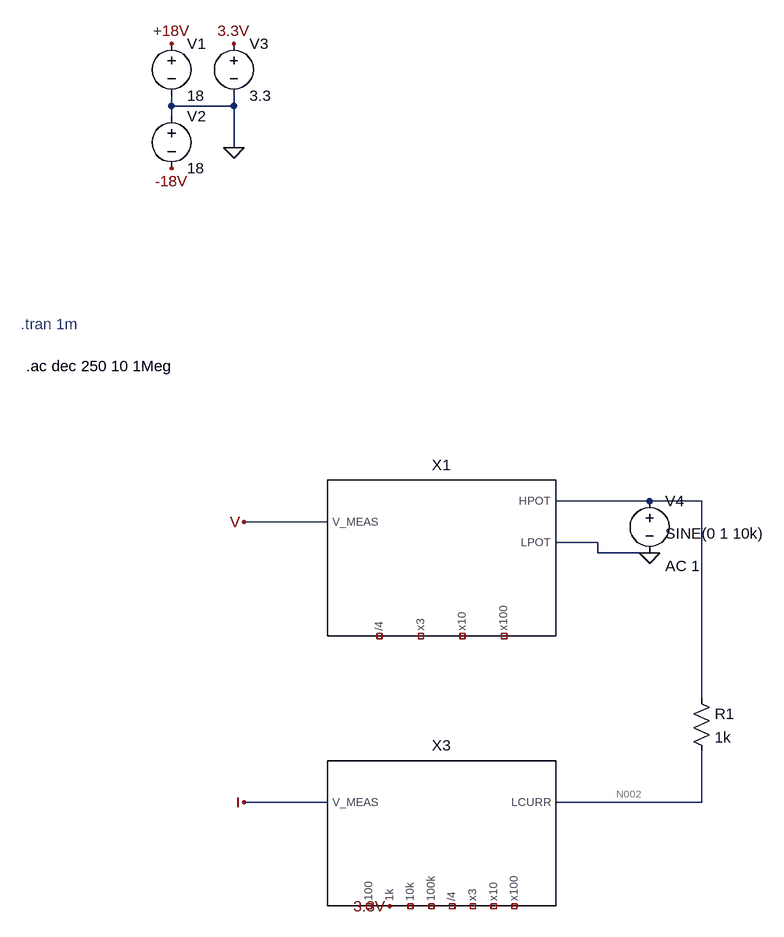
[diagram p0: schematic Characterise.asc]
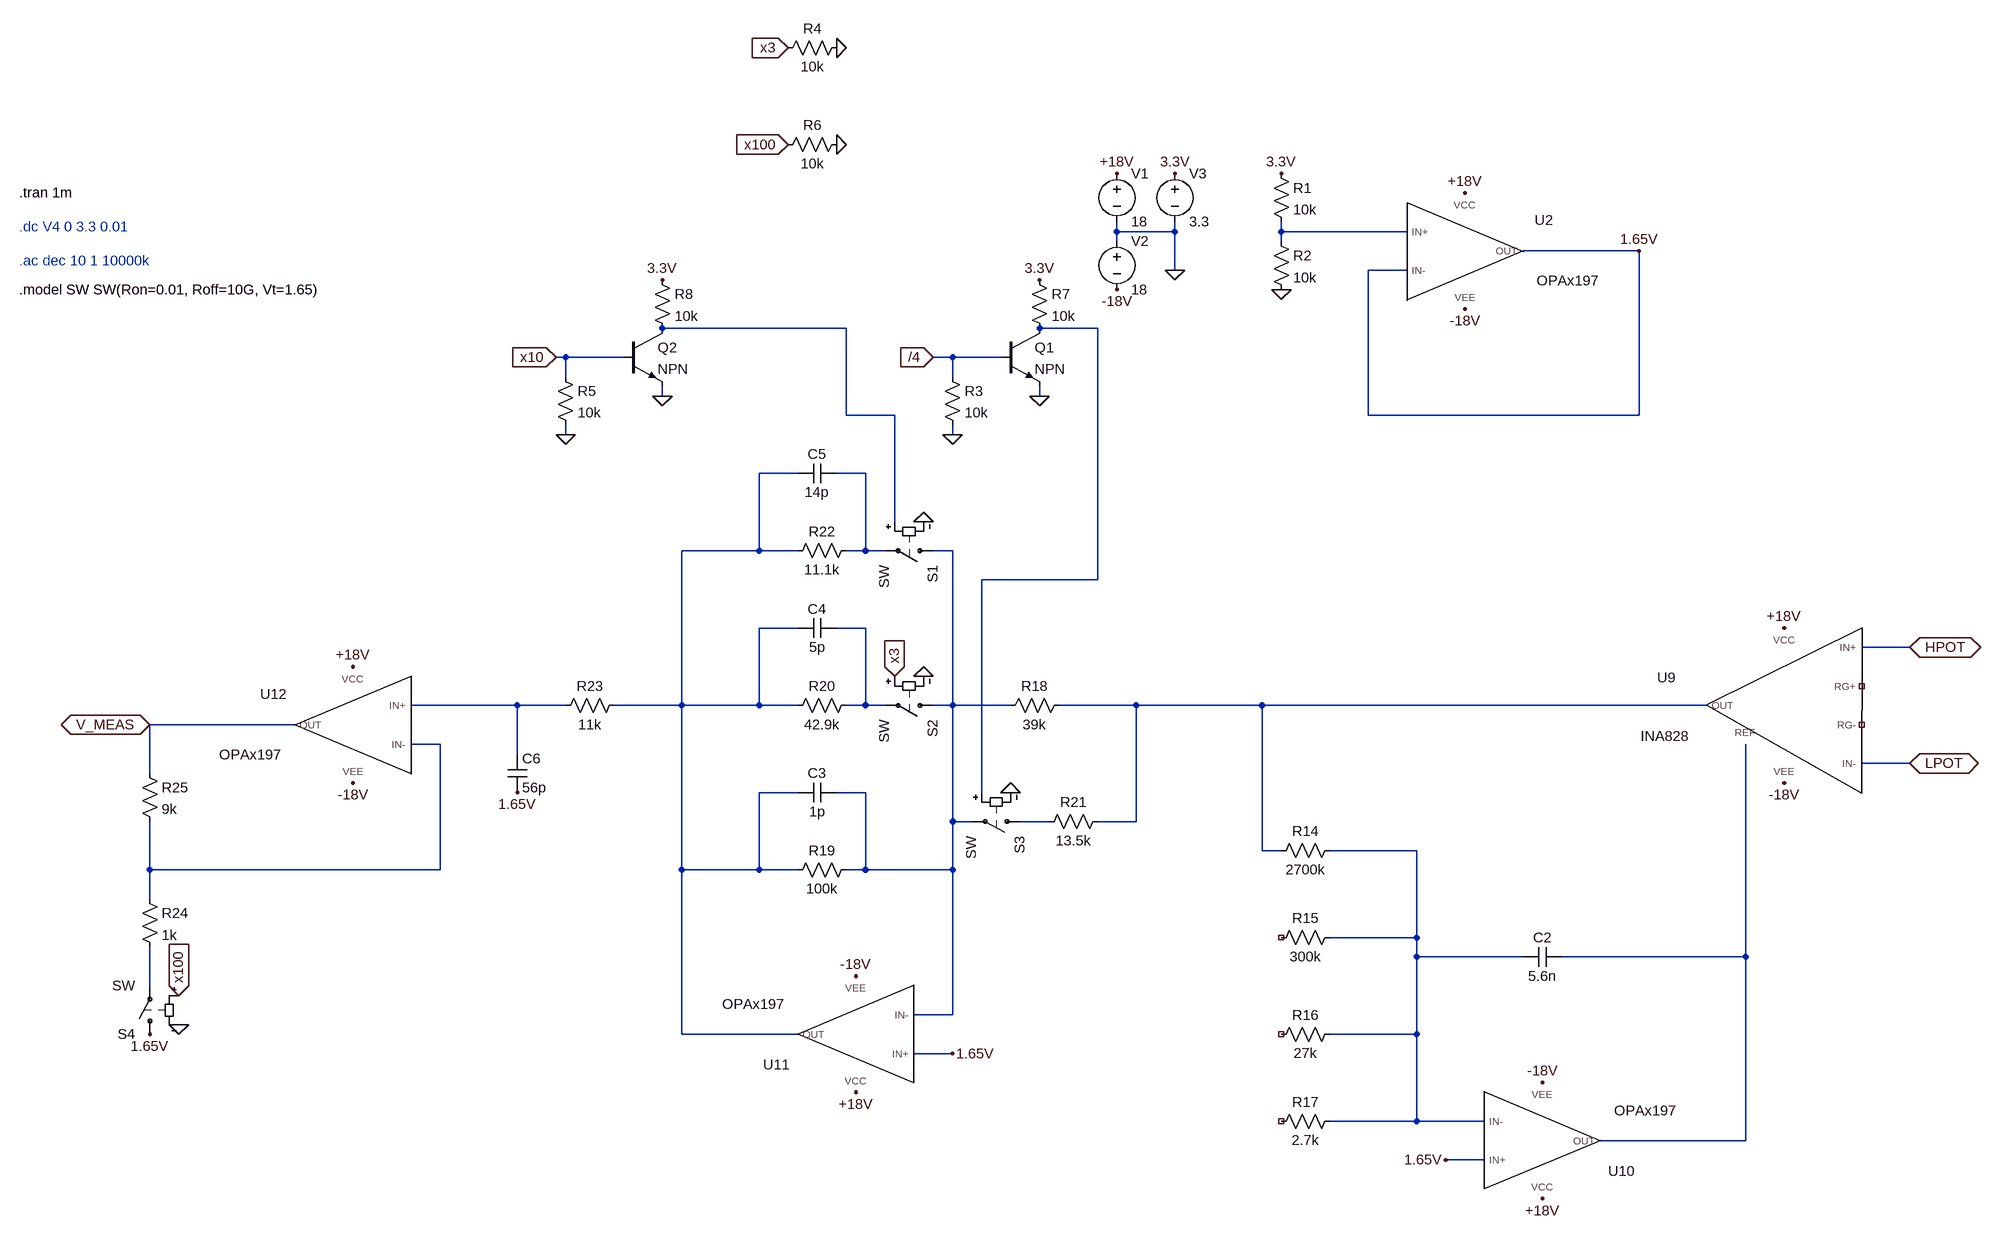
[diagram p1: sub-circuit vamp.asc]
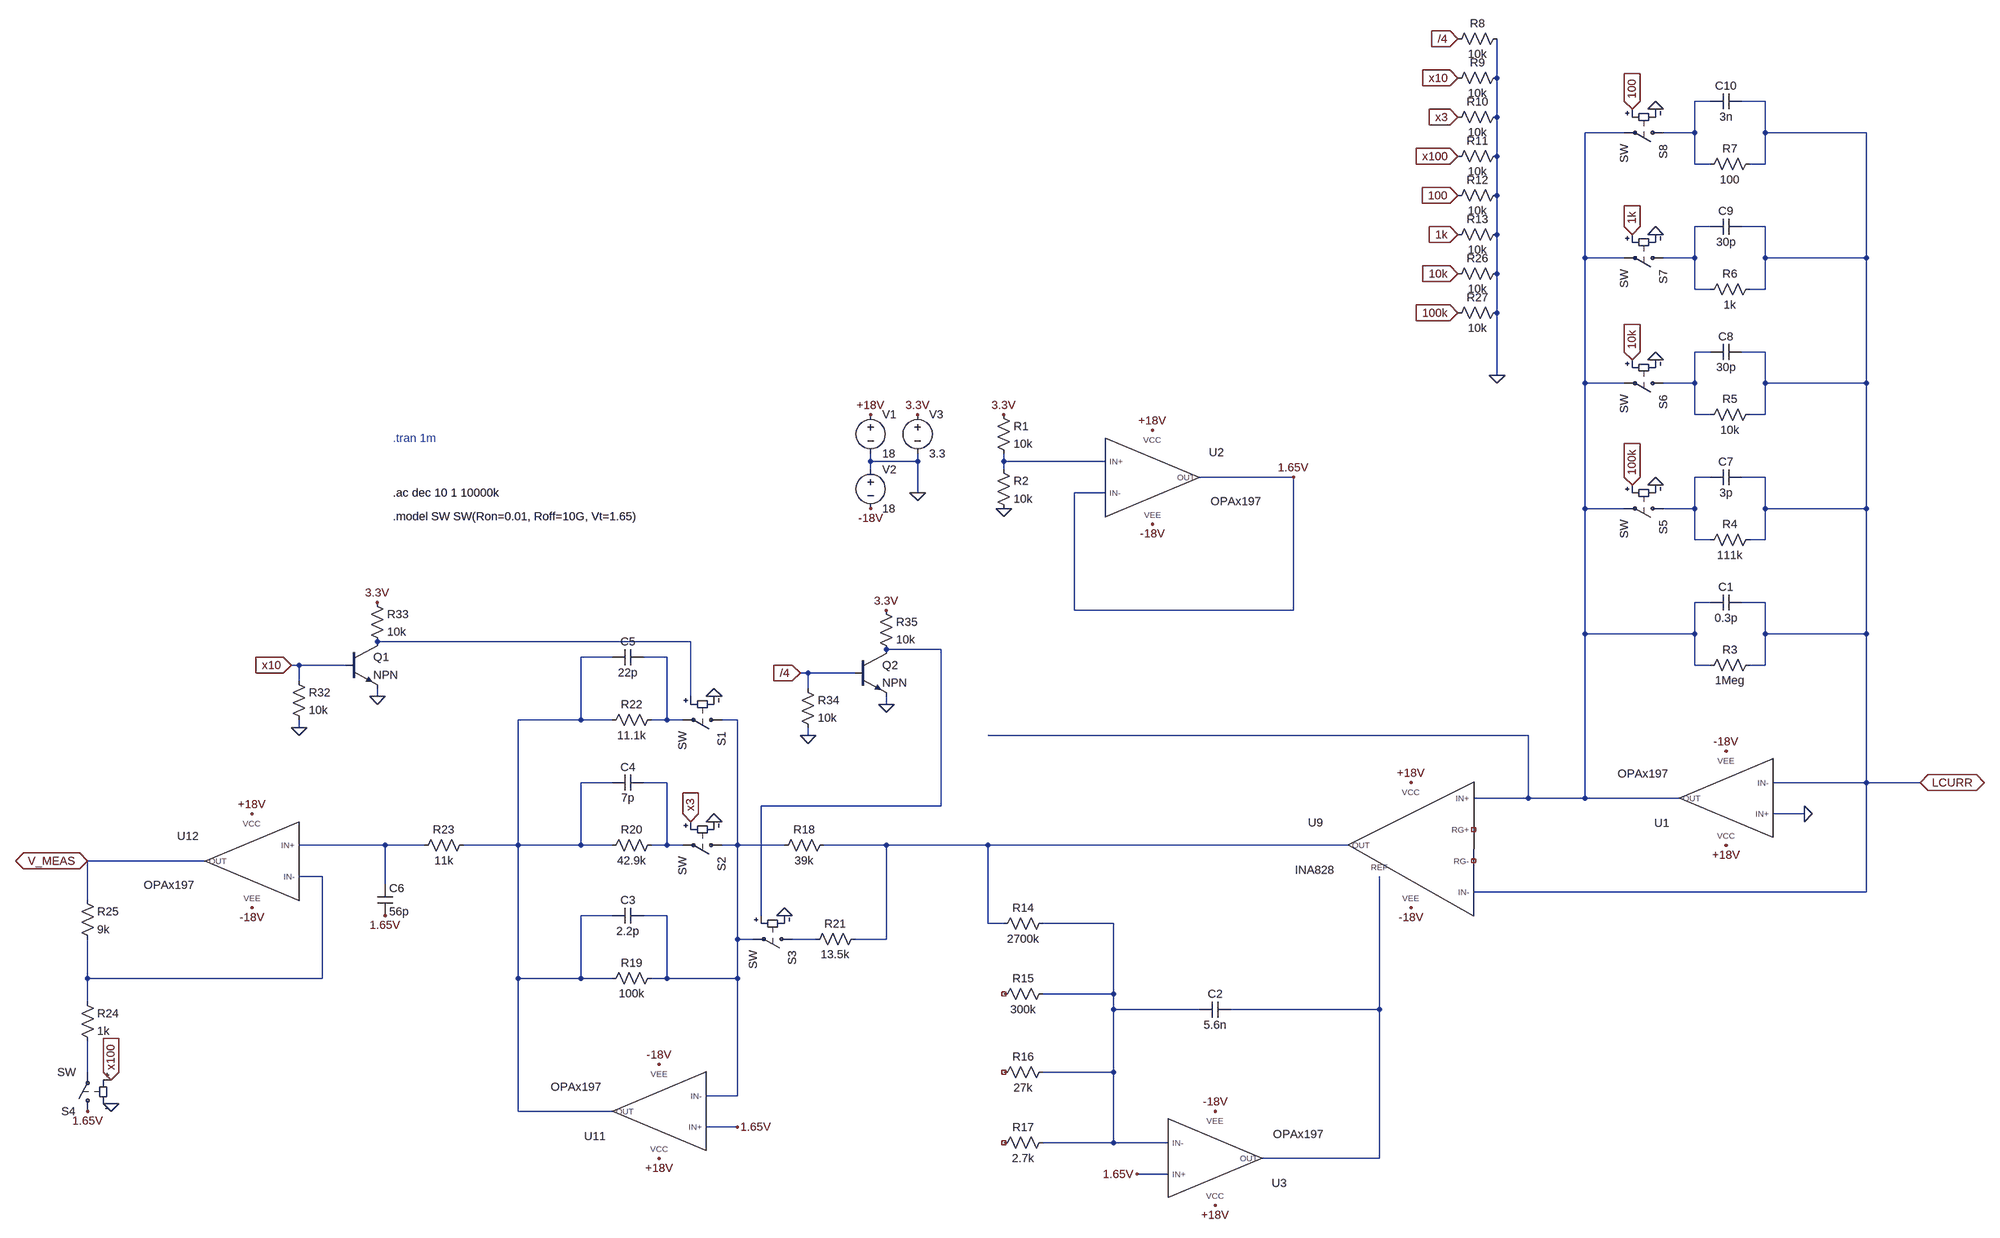
[diagram p2: sub-circuit iamp.asc]
Characterise.asc, the LTspice schematic file:
Version 4.1
SHEET 1 1460 892
WIRE -288 -544 -288 -560
WIRE -192 -544 -192 -560
WIRE -192 -544 -288 -544
WIRE -288 -528 -288 -544
WIRE -192 -480 -192 -544
WIRE 448 64 304 64
WIRE 528 64 448 64
WIRE -48 96 -176 96
WIRE 368 128 304 128
WIRE 368 144 368 128
WIRE 448 144 368 144
WIRE 528 368 528 64
WIRE -48 528 -176 528
WIRE 528 528 528 448
WIRE 528 528 304 528
FLAG -192 -480 0
FLAG -288 -640 +18V
FLAG -288 -448 -18V
FLAG -192 -640 3.3V
FLAG 448 144 0
FLAG -176 96 V
FLAG 48 688 3.3V
FLAG -176 528 I
SYMBOL voltage -288 -656 R0
WINDOW 123 0 0 Left 0
WINDOW 39 0 0 Left 0
SYMATTR InstName V1
SYMATTR Value 18
SYMBOL voltage -288 -544 R0
WINDOW 123 0 0 Left 0
WINDOW 39 0 0 Left 0
SYMATTR InstName V2
SYMATTR Value 18
SYMBOL voltage -192 -656 R0
WINDOW 123 0 0 Left 0
WINDOW 39 0 0 Left 0
SYMATTR InstName V3
SYMATTR Value 3.3
SYMBOL voltage 448 48 R0
WINDOW 3 24 66 Left 2
WINDOW 123 24 116 Left 2
WINDOW 39 0 0 Left 0
SYMATTR Value SINE(0 1 10k)
SYMATTR Value2 AC 1
SYMATTR InstName V4
SYMBOL Vamp 128 96 R0
SYMATTR InstName X1
SYMBOL Iamp 128 592 R0
SYMATTR InstName X3
SYMBOL res 512 352 R0
SYMATTR InstName R1
SYMATTR Value 1k
TEXT -520 -208 Left 2 ;.tran 1m
TEXT -512 -144 Left 2 !.ac dec 250 10 1Meg

vamp.asc, the sub-circuit schematic file:
Version 4.1
SHEET 1 2076 5472
WIRE -16 1648 -16 1632
WIRE 80 1648 80 1632
WIRE 80 1648 -16 1648
WIRE 256 1648 256 1632
WIRE 464 1648 256 1648
WIRE -16 1664 -16 1648
WIRE 256 1664 256 1648
WIRE 848 1680 656 1680
WIRE 80 1712 80 1648
WIRE 464 1712 400 1712
WIRE -464 1808 -768 1808
WIRE -48 1808 -144 1808
WIRE -928 1856 -944 1856
WIRE -832 1856 -928 1856
WIRE -288 1856 -320 1856
WIRE -208 1856 -288 1856
WIRE -928 1888 -928 1856
WIRE -288 1888 -288 1856
WIRE -768 1920 -768 1904
WIRE -144 1920 -144 1904
WIRE -464 1952 -464 1808
WIRE -384 1952 -464 1952
WIRE 400 1952 400 1712
WIRE 848 1952 848 1680
WIRE 848 1952 400 1952
WIRE -928 1984 -928 1968
WIRE -288 1984 -288 1968
WIRE -544 2048 -608 2048
WIRE -432 2048 -480 2048
WIRE -384 2128 -384 1952
WIRE -608 2176 -608 2048
WIRE -608 2176 -736 2176
WIRE -544 2176 -608 2176
WIRE -432 2176 -432 2048
WIRE -432 2176 -464 2176
WIRE -400 2176 -432 2176
WIRE -288 2176 -320 2176
WIRE -48 2224 -48 1808
WIRE -48 2224 -240 2224
WIRE -544 2304 -608 2304
WIRE -432 2304 -480 2304
WIRE 1296 2336 1216 2336
WIRE -1008 2432 -1184 2432
WIRE -928 2432 -1008 2432
WIRE -736 2432 -736 2176
WIRE -736 2432 -848 2432
WIRE -608 2432 -608 2304
WIRE -608 2432 -736 2432
WIRE -544 2432 -608 2432
WIRE -432 2432 -432 2304
WIRE -432 2432 -464 2432
WIRE -400 2432 -432 2432
WIRE -288 2432 -288 2176
WIRE -288 2432 -320 2432
WIRE -192 2432 -288 2432
WIRE 16 2432 -112 2432
WIRE 224 2432 16 2432
WIRE 960 2432 224 2432
WIRE -1376 2464 -1616 2464
WIRE -1136 2496 -1184 2496
WIRE -1008 2512 -1008 2432
WIRE 1296 2528 1216 2528
WIRE -1616 2544 -1616 2464
WIRE -544 2576 -608 2576
WIRE -432 2576 -480 2576
WIRE -240 2576 -240 2224
WIRE -288 2624 -288 2432
WIRE -256 2624 -288 2624
WIRE -128 2624 -176 2624
WIRE 16 2624 16 2432
WIRE 16 2624 -48 2624
WIRE 224 2672 224 2432
WIRE 256 2672 224 2672
WIRE 480 2672 336 2672
WIRE -1616 2704 -1616 2624
WIRE -1136 2704 -1136 2496
WIRE -1136 2704 -1616 2704
WIRE -736 2704 -736 2432
WIRE -608 2704 -608 2576
WIRE -608 2704 -736 2704
WIRE -544 2704 -608 2704
WIRE -432 2704 -432 2576
WIRE -432 2704 -464 2704
WIRE -288 2704 -288 2624
WIRE -288 2704 -432 2704
WIRE -1616 2752 -1616 2704
WIRE 480 2816 480 2672
WIRE 480 2816 336 2816
WIRE 480 2848 480 2816
WIRE 656 2848 480 2848
WIRE 1024 2848 1024 2496
WIRE 1024 2848 720 2848
WIRE -1616 2896 -1616 2832
WIRE -288 2944 -288 2704
WIRE -288 2944 -352 2944
WIRE -736 2976 -736 2704
WIRE -544 2976 -736 2976
WIRE 480 2976 480 2848
WIRE 480 2976 336 2976
WIRE -288 3008 -352 3008
WIRE 480 3120 480 2976
WIRE 480 3120 336 3120
WIRE 592 3120 480 3120
WIRE 1024 3152 1024 2848
WIRE 1024 3152 784 3152
WIRE 592 3184 528 3184
FLAG 80 1712 0
FLAG -16 1552 +18V
FLAG -16 1744 -18V
FLAG 80 1552 3.3V
FLAG 560 1584 +18V
FLAG 560 1776 -18V
FLAG 256 1744 0
FLAG 256 1552 3.3V
FLAG 848 1680 1.65V
FLAG 1296 2336 HPOT
IOPIN 1296 2336 BiDir
FLAG 1296 2528 LPOT
IOPIN 1296 2528 BiDir
FLAG 688 3248 +18V
FLAG 688 3056 -18V
FLAG 528 3184 1.65V
FLAG 1088 2560 -18V
FLAG 1088 2304 +18V
FLAG -448 3072 +18V
FLAG -448 2880 -18V
FLAG -288 3008 1.65V
FLAG -1008 2576 1.65V
FLAG -1280 2368 +18V
FLAG -1280 2560 -18V
FLAG -1616 2464 V_MEAS
IOPIN -1616 2464 BiDir
FLAG -336 2128 0
FLAG -336 2384 0
FLAG -192 2576 0
FLAG -1616 2976 1.65V
FLAG -1568 2960 0
FLAG -1568 2912 x100
IOPIN -1568 2912 In
FLAG -384 2384 x3
IOPIN -384 2384 In
FLAG -944 1856 x10
IOPIN -944 1856 In
FLAG -560 1344 x3
IOPIN -560 1344 In
FLAG -560 1504 x100
IOPIN -560 1504 In
FLAG -320 1856 /4
IOPIN -320 1856 In
FLAG -288 1984 0
FLAG -480 1344 0
FLAG -928 1984 0
FLAG -480 1504 0
FLAG -144 1920 0
FLAG -144 1728 3.3V
FLAG -768 1920 0
FLAG -768 1728 3.3V
SYMBOL voltage -16 1536 R0
WINDOW 123 0 0 Left 0
WINDOW 39 0 0 Left 0
SYMATTR InstName V1
SYMATTR Value 18
SYMBOL voltage -16 1648 R0
WINDOW 123 0 0 Left 0
WINDOW 39 0 0 Left 0
SYMATTR InstName V2
SYMATTR Value 18
SYMBOL voltage 80 1536 R0
WINDOW 123 0 0 Left 0
WINDOW 39 0 0 Left 0
SYMATTR InstName V3
SYMATTR Value 3.3
SYMBOL lib\\sym\\OPAx197 560 1680 R0
SYMATTR InstName U2
SYMBOL res 240 1536 R0
SYMATTR InstName R1
SYMATTR Value 10k
SYMBOL res 240 1648 R0
SYMATTR InstName R2
SYMATTR Value 10k
SYMBOL lib\\sym\\INA828 1088 2432 M0
SYMATTR InstName U9
SYMBOL res 352 2656 R90
WINDOW 0 0 56 VBottom 2
WINDOW 3 32 56 VTop 2
SYMATTR InstName R14
SYMATTR Value 2700k
SYMBOL res 352 2800 R90
WINDOW 0 0 56 VBottom 2
WINDOW 3 32 56 VTop 2
SYMATTR InstName R15
SYMATTR Value 300k
SYMBOL res 352 2960 R90
WINDOW 0 0 56 VBottom 2
WINDOW 3 32 56 VTop 2
SYMATTR InstName R16
SYMATTR Value 27k
SYMBOL res 352 3104 R90
WINDOW 0 0 56 VBottom 2
WINDOW 3 32 56 VTop 2
SYMATTR InstName R17
SYMATTR Value 2.7k
SYMBOL lib\\sym\\OPAx197 688 3152 M180
SYMATTR InstName U10
SYMBOL cap 720 2832 R90
WINDOW 0 0 32 VBottom 2
WINDOW 3 32 32 VTop 2
SYMATTR InstName C2
SYMATTR Value 5.6n
SYMBOL res -96 2416 R90
WINDOW 0 0 56 VBottom 2
WINDOW 3 32 56 VTop 2
SYMATTR InstName R18
SYMATTR Value 39k
SYMBOL lib\\sym\\OPAx197 -448 2976 R180
SYMATTR InstName U11
SYMBOL res -448 2688 R90
WINDOW 0 0 56 VBottom 2
WINDOW 3 32 56 VTop 2
SYMATTR InstName R19
SYMATTR Value 100k
SYMBOL cap -480 2560 R90
WINDOW 0 0 32 VBottom 2
WINDOW 3 32 32 VTop 2
SYMATTR InstName C3
SYMATTR Value 1p
SYMBOL res -32 2608 R90
WINDOW 0 0 56 VBottom 2
WINDOW 3 32 56 VTop 2
SYMATTR InstName R21
SYMATTR Value 13.5k
SYMBOL res -448 2416 R90
WINDOW 0 0 56 VBottom 2
WINDOW 3 32 56 VTop 2
SYMATTR InstName R20
SYMATTR Value 42.9k
SYMBOL cap -480 2288 R90
WINDOW 0 0 32 VBottom 2
WINDOW 3 32 32 VTop 2
SYMATTR InstName C4
SYMATTR Value 5p
SYMBOL res -448 2160 R90
WINDOW 0 0 56 VBottom 2
WINDOW 3 32 56 VTop 2
SYMATTR InstName R22
SYMATTR Value 11.1k
SYMBOL cap -480 2032 R90
WINDOW 0 0 32 VBottom 2
WINDOW 3 32 32 VTop 2
SYMATTR InstName C5
SYMATTR Value 14p
SYMBOL res -832 2416 R90
WINDOW 0 0 56 VBottom 2
WINDOW 3 32 56 VTop 2
SYMATTR InstName R23
SYMATTR Value 11k
SYMBOL cap -1024 2512 R0
SYMATTR InstName C6
SYMATTR Value 56p
SYMBOL lib\\sym\\OPAx197 -1280 2464 M0
SYMATTR InstName U12
SYMBOL res -1632 2736 R0
SYMATTR InstName R24
SYMATTR Value 1k
SYMBOL res -1632 2528 R0
SYMATTR InstName R25
SYMATTR Value 9k
SYMBOL sw -304 2176 R90
SYMATTR InstName S1
SYMBOL sw -304 2432 R90
SYMATTR InstName S2
SYMBOL sw -160 2624 R90
SYMATTR InstName S3
SYMBOL sw -1616 2992 R180
SYMATTR InstName S4
SYMBOL res -304 1872 R0
SYMATTR InstName R3
SYMATTR Value 10k
SYMBOL res -464 1328 R90
WINDOW 0 0 56 VBottom 2
WINDOW 3 32 56 VTop 2
SYMATTR InstName R4
SYMATTR Value 10k
SYMBOL res -944 1872 R0
SYMATTR InstName R5
SYMATTR Value 10k
SYMBOL res -464 1488 R90
WINDOW 0 0 56 VBottom 2
WINDOW 3 32 56 VTop 2
SYMATTR InstName R6
SYMATTR Value 10k
SYMBOL npn -208 1808 R0
SYMATTR InstName Q1
SYMBOL res -160 1712 R0
SYMATTR InstName R7
SYMATTR Value 10k
SYMBOL npn -832 1808 R0
SYMATTR InstName Q2
SYMBOL res -784 1712 R0
SYMATTR InstName R8
SYMATTR Value 10k
TEXT -1832 1584 Left 2 !.tran 1m
TEXT -1832 1640 Left 2 ;.dc V4 0 3.3 0.01
TEXT -1832 1696 Left 2 ;.ac dec 10 1 10000k
TEXT -1832 1744 Left 2 !.model SW SW(Ron=0.01, Roff=10G, Vt=1.65)

iamp.asc, the sub-circuit schematic file:
Version 4.1
SHEET 1 3436 5472
WIRE 1264 864 1264 784
WIRE 2480 912 2448 912
WIRE 2592 912 2544 912
WIRE 1264 944 1264 864
WIRE 2304 976 2224 976
WIRE 2448 976 2448 912
WIRE 2448 976 2384 976
WIRE 2592 976 2592 912
WIRE 2880 976 2592 976
WIRE 1264 1024 1264 944
WIRE 2448 1040 2448 976
WIRE 2480 1040 2448 1040
WIRE 2592 1040 2592 976
WIRE 2592 1040 2560 1040
WIRE 1264 1104 1264 1024
WIRE 2480 1168 2448 1168
WIRE 2592 1168 2544 1168
WIRE 1264 1184 1264 1104
WIRE 2224 1232 2224 976
WIRE 2304 1232 2224 1232
WIRE 2448 1232 2448 1168
WIRE 2448 1232 2384 1232
WIRE 2592 1232 2592 1168
WIRE 2880 1232 2880 976
WIRE 2880 1232 2592 1232
WIRE 1264 1264 1264 1184
WIRE 2448 1296 2448 1232
WIRE 2480 1296 2448 1296
WIRE 2592 1296 2592 1232
WIRE 2592 1296 2560 1296
WIRE 1264 1344 1264 1264
WIRE 2480 1424 2448 1424
WIRE 2592 1424 2544 1424
WIRE 1264 1472 1264 1344
WIRE 2224 1488 2224 1232
WIRE 2304 1488 2224 1488
WIRE 2448 1488 2448 1424
WIRE 2448 1488 2384 1488
WIRE 2592 1488 2592 1424
WIRE 2880 1488 2880 1232
WIRE 2880 1488 2592 1488
WIRE 2448 1552 2448 1488
WIRE 2480 1552 2448 1552
WIRE 2592 1552 2592 1488
WIRE 2592 1552 2560 1552
WIRE -16 1648 -16 1632
WIRE 80 1648 80 1632
WIRE 80 1648 -16 1648
WIRE 256 1648 256 1632
WIRE 464 1648 256 1648
WIRE -16 1664 -16 1648
WIRE 256 1664 256 1648
WIRE 848 1680 656 1680
WIRE 2480 1680 2448 1680
WIRE 2592 1680 2544 1680
WIRE 80 1712 80 1648
WIRE 464 1712 400 1712
WIRE 2224 1744 2224 1488
WIRE 2304 1744 2224 1744
WIRE 2448 1744 2448 1680
WIRE 2448 1744 2384 1744
WIRE 2592 1744 2592 1680
WIRE 2880 1744 2880 1488
WIRE 2880 1744 2592 1744
WIRE 2448 1808 2448 1744
WIRE 2480 1808 2448 1808
WIRE 2592 1808 2592 1744
WIRE 2592 1808 2560 1808
WIRE 2480 1936 2448 1936
WIRE 2592 1936 2544 1936
WIRE 400 1952 400 1712
WIRE 848 1952 848 1680
WIRE 848 1952 400 1952
WIRE 2224 2000 2224 1744
WIRE 2448 2000 2448 1936
WIRE 2448 2000 2224 2000
WIRE 2592 2000 2592 1936
WIRE 2880 2000 2880 1744
WIRE 2880 2000 2592 2000
WIRE -384 2016 -1024 2016
WIRE 128 2032 16 2032
WIRE -544 2048 -608 2048
WIRE -432 2048 -480 2048
WIRE -1184 2064 -1200 2064
WIRE -1088 2064 -1184 2064
WIRE 2448 2064 2448 2000
WIRE 2480 2064 2448 2064
WIRE 2592 2064 2592 2000
WIRE 2592 2064 2560 2064
WIRE -144 2080 -160 2080
WIRE -48 2080 -144 2080
WIRE -1184 2096 -1184 2064
WIRE -144 2112 -144 2080
WIRE -1024 2128 -1024 2112
WIRE -384 2128 -384 2016
WIRE 16 2144 16 2128
WIRE -608 2176 -608 2048
WIRE -608 2176 -736 2176
WIRE -544 2176 -608 2176
WIRE -432 2176 -432 2048
WIRE -432 2176 -464 2176
WIRE -400 2176 -432 2176
WIRE -288 2176 -320 2176
WIRE -1184 2192 -1184 2176
WIRE -144 2208 -144 2192
WIRE 1328 2208 224 2208
WIRE -544 2304 -608 2304
WIRE -432 2304 -480 2304
WIRE 2880 2304 2880 2000
WIRE 2880 2304 2608 2304
WIRE 2992 2304 2880 2304
WIRE 1328 2336 1328 2208
WIRE 1328 2336 1216 2336
WIRE 2224 2336 2224 2000
WIRE 2224 2336 1328 2336
WIRE 2416 2336 2224 2336
WIRE 128 2352 128 2032
WIRE 128 2352 -240 2352
WIRE 2672 2368 2608 2368
WIRE -1008 2432 -1184 2432
WIRE -928 2432 -1008 2432
WIRE -736 2432 -736 2176
WIRE -736 2432 -848 2432
WIRE -608 2432 -608 2304
WIRE -608 2432 -736 2432
WIRE -544 2432 -608 2432
WIRE -432 2432 -432 2304
WIRE -432 2432 -464 2432
WIRE -400 2432 -432 2432
WIRE -288 2432 -288 2176
WIRE -288 2432 -320 2432
WIRE -192 2432 -288 2432
WIRE 16 2432 -112 2432
WIRE 224 2432 16 2432
WIRE 960 2432 224 2432
WIRE -1376 2464 -1616 2464
WIRE -1136 2496 -1184 2496
WIRE -1008 2512 -1008 2432
WIRE 2880 2528 2880 2304
WIRE 2880 2528 1216 2528
WIRE -1616 2544 -1616 2464
WIRE -544 2576 -608 2576
WIRE -432 2576 -480 2576
WIRE -240 2576 -240 2352
WIRE 224 2592 224 2432
WIRE 256 2592 224 2592
WIRE 480 2592 336 2592
WIRE -288 2624 -288 2432
WIRE -256 2624 -288 2624
WIRE -128 2624 -176 2624
WIRE 16 2624 16 2432
WIRE 16 2624 -48 2624
WIRE -1616 2704 -1616 2624
WIRE -1136 2704 -1136 2496
WIRE -1136 2704 -1616 2704
WIRE -736 2704 -736 2432
WIRE -608 2704 -608 2576
WIRE -608 2704 -736 2704
WIRE -544 2704 -608 2704
WIRE -432 2704 -432 2576
WIRE -432 2704 -464 2704
WIRE -288 2704 -288 2624
WIRE -288 2704 -432 2704
WIRE 480 2736 480 2592
WIRE 480 2736 336 2736
WIRE -1616 2752 -1616 2704
WIRE 480 2768 480 2736
WIRE 656 2768 480 2768
WIRE 1024 2768 1024 2496
WIRE 1024 2768 720 2768
WIRE -1616 2896 -1616 2832
WIRE 480 2896 480 2768
WIRE 480 2896 336 2896
WIRE -288 2944 -288 2704
WIRE -288 2944 -352 2944
WIRE -736 2976 -736 2704
WIRE -544 2976 -736 2976
WIRE -288 3008 -352 3008
WIRE 480 3040 480 2896
WIRE 480 3040 336 3040
WIRE 592 3040 480 3040
WIRE 1024 3072 1024 2768
WIRE 1024 3072 784 3072
WIRE 592 3104 528 3104
FLAG 80 1712 0
FLAG -16 1552 +18V
FLAG -16 1744 -18V
FLAG 80 1552 3.3V
FLAG 560 1584 +18V
FLAG 560 1776 -18V
FLAG 256 1744 0
FLAG 256 1552 3.3V
FLAG 848 1680 1.65V
FLAG 2992 2304 LCURR
IOPIN 2992 2304 BiDir
FLAG 1088 2560 -18V
FLAG 1088 2304 +18V
FLAG -448 3072 +18V
FLAG -448 2880 -18V
FLAG -288 3008 1.65V
FLAG -1008 2576 1.65V
FLAG -1280 2368 +18V
FLAG -1280 2560 -18V
FLAG -1616 2464 V_MEAS
IOPIN -1616 2464 BiDir
FLAG -336 2128 0
FLAG -336 2384 0
FLAG -192 2576 0
FLAG -1616 2976 1.65V
FLAG -1568 2960 0
FLAG -1568 2912 x100
IOPIN -1568 2912 In
FLAG -384 2384 x3
IOPIN -384 2384 In
FLAG -160 2080 /4
IOPIN -160 2080 In
FLAG 2512 2432 +18V
FLAG 2512 2240 -18V
FLAG 2368 1696 0
FLAG 2320 1696 100k
IOPIN 2320 1696 In
FLAG 2368 1440 0
FLAG 2320 1440 10k
IOPIN 2320 1440 In
FLAG 2368 1184 0
FLAG 2320 1184 1k
IOPIN 2320 1184 In
FLAG 2368 928 0
FLAG 2320 928 100
IOPIN 2320 928 In
FLAG 1184 1024 x100
IOPIN 1184 1024 In
FLAG 1184 864 x10
IOPIN 1184 864 In
FLAG 1184 784 /4
IOPIN 1184 784 In
FLAG 1184 944 x3
IOPIN 1184 944 In
FLAG 1184 1104 100
IOPIN 1184 1104 In
FLAG 1184 1184 1k
IOPIN 1184 1184 In
FLAG 1184 1264 10k
IOPIN 1184 1264 In
FLAG 1184 1344 100k
IOPIN 1184 1344 In
FLAG 1264 1472 0
FLAG 2672 2368 0
FLAG -1200 2064 x10
IOPIN -1200 2064 In
FLAG -1184 2192 0
FLAG -1024 2128 0
FLAG -1024 1936 3.3V
FLAG -144 2208 0
FLAG 16 2144 0
FLAG 16 1952 3.3V
FLAG 688 3168 +18V
FLAG 688 2976 -18V
FLAG 528 3104 1.65V
SYMBOL voltage -16 1536 R0
WINDOW 123 0 0 Left 0
WINDOW 39 0 0 Left 0
SYMATTR InstName V1
SYMATTR Value 18
SYMBOL voltage -16 1648 R0
WINDOW 123 0 0 Left 0
WINDOW 39 0 0 Left 0
SYMATTR InstName V2
SYMATTR Value 18
SYMBOL voltage 80 1536 R0
WINDOW 123 0 0 Left 0
WINDOW 39 0 0 Left 0
SYMATTR InstName V3
SYMATTR Value 3.3
SYMBOL lib\\sym\\OPAx197 560 1680 R0
SYMATTR InstName U2
SYMBOL res 240 1536 R0
SYMATTR InstName R1
SYMATTR Value 10k
SYMBOL res 240 1648 R0
SYMATTR InstName R2
SYMATTR Value 10k
SYMBOL lib\\sym\\INA828 1088 2432 M0
SYMATTR InstName U9
SYMBOL res -96 2416 R90
WINDOW 0 0 56 VBottom 2
WINDOW 3 32 56 VTop 2
SYMATTR InstName R18
SYMATTR Value 39k
SYMBOL lib\\sym\\OPAx197 -448 2976 R180
SYMATTR InstName U11
SYMBOL res -448 2688 R90
WINDOW 0 0 56 VBottom 2
WINDOW 3 32 56 VTop 2
SYMATTR InstName R19
SYMATTR Value 100k
SYMBOL cap -480 2560 R90
WINDOW 0 0 32 VBottom 2
WINDOW 3 32 32 VTop 2
SYMATTR InstName C3
SYMATTR Value 2.2p
SYMBOL res -32 2608 R90
WINDOW 0 0 56 VBottom 2
WINDOW 3 32 56 VTop 2
SYMATTR InstName R21
SYMATTR Value 13.5k
SYMBOL res -448 2416 R90
WINDOW 0 0 56 VBottom 2
WINDOW 3 32 56 VTop 2
SYMATTR InstName R20
SYMATTR Value 42.9k
SYMBOL cap -480 2288 R90
WINDOW 0 0 32 VBottom 2
WINDOW 3 32 32 VTop 2
SYMATTR InstName C4
SYMATTR Value 7p
SYMBOL res -448 2160 R90
WINDOW 0 0 56 VBottom 2
WINDOW 3 32 56 VTop 2
SYMATTR InstName R22
SYMATTR Value 11.1k
SYMBOL cap -480 2032 R90
WINDOW 0 0 32 VBottom 2
WINDOW 3 32 32 VTop 2
SYMATTR InstName C5
SYMATTR Value 22p
SYMBOL res -832 2416 R90
WINDOW 0 0 56 VBottom 2
WINDOW 3 32 56 VTop 2
SYMATTR InstName R23
SYMATTR Value 11k
SYMBOL cap -1024 2512 R0
SYMATTR InstName C6
SYMATTR Value 56p
SYMBOL lib\\sym\\OPAx197 -1280 2464 M0
SYMATTR InstName U12
SYMBOL res -1632 2736 R0
SYMATTR InstName R24
SYMATTR Value 1k
SYMBOL res -1632 2528 R0
SYMATTR InstName R25
SYMATTR Value 9k
SYMBOL sw -304 2176 R90
SYMATTR InstName S1
SYMBOL sw -304 2432 R90
SYMATTR InstName S2
SYMBOL sw -160 2624 R90
SYMATTR InstName S3
SYMBOL sw -1616 2992 R180
SYMATTR InstName S4
SYMBOL lib\\sym\\OPAx197 2512 2336 R180
SYMATTR InstName U1
SYMBOL res 2576 2048 R90
WINDOW 0 0 56 VBottom 2
WINDOW 3 32 56 VTop 2
SYMATTR InstName R3
SYMATTR Value 1Meg
SYMBOL cap 2544 1920 R90
WINDOW 0 0 32 VBottom 2
WINDOW 3 32 32 VTop 2
SYMATTR InstName C1
SYMATTR Value 0.3p
SYMBOL res 2576 1792 R90
WINDOW 0 0 56 VBottom 2
WINDOW 3 32 56 VTop 2
SYMATTR InstName R4
SYMATTR Value 111k
SYMBOL cap 2544 1664 R90
WINDOW 0 0 32 VBottom 2
WINDOW 3 32 32 VTop 2
SYMATTR InstName C7
SYMATTR Value 3p
SYMBOL res 2576 1536 R90
WINDOW 0 0 56 VBottom 2
WINDOW 3 32 56 VTop 2
SYMATTR InstName R5
SYMATTR Value 10k
SYMBOL cap 2544 1408 R90
WINDOW 0 0 32 VBottom 2
WINDOW 3 32 32 VTop 2
SYMATTR InstName C8
SYMATTR Value 30p
SYMBOL res 2576 1280 R90
WINDOW 0 0 56 VBottom 2
WINDOW 3 32 56 VTop 2
SYMATTR InstName R6
SYMATTR Value 1k
SYMBOL cap 2544 1152 R90
WINDOW 0 0 32 VBottom 2
WINDOW 3 32 32 VTop 2
SYMATTR InstName C9
SYMATTR Value 30p
SYMBOL res 2576 1024 R90
WINDOW 0 0 56 VBottom 2
WINDOW 3 32 56 VTop 2
SYMATTR InstName R7
SYMATTR Value 100
SYMBOL cap 2544 896 R90
WINDOW 0 0 32 VBottom 2
WINDOW 3 32 32 VTop 2
SYMATTR InstName C10
SYMATTR Value 3n
SYMBOL sw 2400 1744 R90
SYMATTR InstName S5
SYMBOL sw 2400 1488 R90
SYMATTR InstName S6
SYMBOL sw 2400 1232 R90
SYMATTR InstName S7
SYMBOL sw 2400 976 R90
SYMATTR InstName S8
SYMBOL res 1280 768 R90
WINDOW 0 0 56 VBottom 2
WINDOW 3 32 56 VTop 2
SYMATTR InstName R8
SYMATTR Value 10k
SYMBOL res 1280 848 R90
WINDOW 0 0 56 VBottom 2
WINDOW 3 32 56 VTop 2
SYMATTR InstName R9
SYMATTR Value 10k
SYMBOL res 1280 928 R90
WINDOW 0 0 56 VBottom 2
WINDOW 3 32 56 VTop 2
SYMATTR InstName R10
SYMATTR Value 10k
SYMBOL res 1280 1008 R90
WINDOW 0 0 56 VBottom 2
WINDOW 3 32 56 VTop 2
SYMATTR InstName R11
SYMATTR Value 10k
SYMBOL res 1280 1088 R90
WINDOW 0 0 56 VBottom 2
WINDOW 3 32 56 VTop 2
SYMATTR InstName R12
SYMATTR Value 10k
SYMBOL res 1280 1168 R90
WINDOW 0 0 56 VBottom 2
WINDOW 3 32 56 VTop 2
SYMATTR InstName R13
SYMATTR Value 10k
SYMBOL res 1280 1248 R90
WINDOW 0 0 56 VBottom 2
WINDOW 3 32 56 VTop 2
SYMATTR InstName R26
SYMATTR Value 10k
SYMBOL res 1280 1328 R90
WINDOW 0 0 56 VBottom 2
WINDOW 3 32 56 VTop 2
SYMATTR InstName R27
SYMATTR Value 10k
SYMBOL res -1200 2080 R0
SYMATTR InstName R32
SYMATTR Value 10k
SYMBOL npn -1088 2016 R0
SYMATTR InstName Q1
SYMBOL res -1040 1920 R0
SYMATTR InstName R33
SYMATTR Value 10k
SYMBOL res -160 2096 R0
SYMATTR InstName R34
SYMATTR Value 10k
SYMBOL npn -48 2032 R0
SYMATTR InstName Q2
SYMBOL res 0 1936 R0
SYMATTR InstName R35
SYMATTR Value 10k
SYMBOL res 352 2576 R90
WINDOW 0 0 56 VBottom 2
WINDOW 3 32 56 VTop 2
SYMATTR InstName R14
SYMATTR Value 2700k
SYMBOL res 352 2720 R90
WINDOW 0 0 56 VBottom 2
WINDOW 3 32 56 VTop 2
SYMATTR InstName R15
SYMATTR Value 300k
SYMBOL res 352 2880 R90
WINDOW 0 0 56 VBottom 2
WINDOW 3 32 56 VTop 2
SYMATTR InstName R16
SYMATTR Value 27k
SYMBOL res 352 3024 R90
WINDOW 0 0 56 VBottom 2
WINDOW 3 32 56 VTop 2
SYMATTR InstName R17
SYMATTR Value 2.7k
SYMBOL lib\\sym\\OPAx197 688 3072 M180
SYMATTR InstName U3
SYMBOL cap 720 2752 R90
WINDOW 0 0 32 VBottom 2
WINDOW 3 32 32 VTop 2
SYMATTR InstName C2
SYMATTR Value 5.6n
TEXT -992 1600 Left 2 ;.tran 1m
TEXT -992 1712 Left 2 !.ac dec 10 1 10000k
TEXT -992 1760 Left 2 !.model SW SW(Ron=0.01, Roff=10G, Vt=1.65)

The netlist it stands for:
* Characterise.asc
V1 +18V 0 18
V2 0 -18V 18
V3 3.3V 0 3.3
V4 N001 0 SINE(0 1 10k) AC 1
X§X1 NC_01 NC_02 NC_03 NC_04 N001 0 V vamp
X§X3 NC_05 NC_06 NC_07 NC_08 3.3V NC_09 NC_10 NC_11 N002 I iamp
R1 N001 N002 1k

* block symbol definitions
.subckt vamp /4 x10 x100 x3 HPOT LPOT V_MEAS
V1 +18V 0 18
V2 0 -18V 18
V3 3.3V 0 3.3
X§U2 N001 1.65V +18V -18V 1.65V OPAx197  ; pins IN+ IN- VCC VEE OUT
R1 3.3V N001 10k
R2 N001 0 10k
X§U9 HPOT LPOT +18V -18V N009 N013 NC_01 NC_02 INA828  ; pins IN+ IN- VCC VEE OUT REF RG+ RG-
R14 N012 N009 2700k
R15 N012 NC_03 300k
R16 N012 NC_04 27k
R17 N012 NC_05 2.7k
X§U10 1.65V N012 +18V -18V N013 OPAx197  ; pins IN+ IN- VCC VEE OUT
C2 N013 N012 5.6n
R18 N009 N006 39k
X§U11 1.65V N006 +18V -18V N004 OPAx197  ; pins IN+ IN- VCC VEE OUT
R19 N006 N004 100k
C3 N006 N004 1p
R21 N009 N011 13.5k
R20 N007 N004 42.9k
C4 N007 N004 5p
R22 N005 N004 11.1k
C5 N005 N004 14p
R23 N004 N008 11k
C6 N008 1.65V 56p
X§U12 N008 N010 +18V -18V V_MEAS OPAx197  ; pins IN+ IN- VCC VEE OUT
R24 N010 N014 1k
R25 V_MEAS N010 9k
S1 N006 N005 N002 0 SW
S2 N006 N007 x3 0 SW
S3 N011 N006 N003 0 SW
S4 1.65V N014 x100 0 SW
R3 /4 0 10k
R4 0 x3 10k
R5 x10 0 10k
R6 0 x100 10k
Q1 N003 /4 0 0 NPN
R7 3.3V N003 10k
Q2 N002 x10 0 0 NPN
R8 3.3V N002 10k
.tran 1m
* .dc V4 0 3.3 0.01
* .ac dec 10 1 10000k
.model SW SW(Ron=0.01, Roff=10G, Vt=1.65)
.ends vamp

.subckt iamp /4 100 100k 10k 1k x10 x100 x3 LCURR V_MEAS
V1 +18V 0 18
V2 0 -18V 18
V3 3.3V 0 3.3
X§U2 N005 1.65V +18V -18V 1.65V OPAx197  ; pins IN+ IN- VCC VEE OUT
R1 3.3V N005 10k
R2 N005 0 10k
X§U9 N002 LCURR +18V -18V N014 N018 NC_01 NC_02 INA828  ; pins IN+ IN- VCC VEE OUT REF RG+ RG-
R18 N014 N011 39k
X§U11 1.65V N011 +18V -18V N009 OPAx197  ; pins IN+ IN- VCC VEE OUT
R19 N011 N009 100k
C3 N011 N009 2.2p
R21 N014 N017 13.5k
R20 N012 N009 42.9k
C4 N012 N009 7p
R22 N010 N009 11.1k
C5 N010 N009 22p
R23 N009 N013 11k
C6 N013 1.65V 56p
X§U12 N013 N015 +18V -18V V_MEAS OPAx197  ; pins IN+ IN- VCC VEE OUT
R24 N015 N019 1k
R25 V_MEAS N015 9k
S1 N011 N010 N007 0 SW
S2 N011 N012 x3 0 SW
S3 N017 N011 N008 0 SW
S4 1.65V N019 x100 0 SW
X§U1 0 LCURR +18V -18V N002 OPAx197  ; pins IN+ IN- VCC VEE OUT
R3 LCURR N002 1Meg
C1 LCURR N002 0.3p
R4 LCURR N006 111k
C7 LCURR N006 3p
R5 LCURR N004 10k
C8 LCURR N004 30p
R6 LCURR N003 1k
C9 LCURR N003 30p
R7 LCURR N001 100
C10 LCURR N001 3n
S5 N006 N002 100k 0 SW
S6 N004 N002 10k 0 SW
S7 N003 N002 1k 0 SW
S8 N001 N002 100 0 SW
R8 0 /4 10k
R9 0 x10 10k
R10 0 x3 10k
R11 0 x100 10k
R12 0 100 10k
R13 0 1k 10k
R26 0 10k 10k
R27 0 100k 10k
R32 x10 0 10k
Q1 N007 x10 0 0 NPN
R33 3.3V N007 10k
R34 /4 0 10k
Q2 N008 /4 0 0 NPN
R35 3.3V N008 10k
R14 N016 N014 2700k
R15 N016 NC_03 300k
R16 N016 NC_04 27k
R17 N016 NC_05 2.7k
X§U3 1.65V N016 +18V -18V N018 OPAx197  ; pins IN+ IN- VCC VEE OUT
C2 N018 N016 5.6n
* .tran 1m
.ac dec 10 1 10000k
.model SW SW(Ron=0.01, Roff=10G, Vt=1.65)
.ends iamp

.model NPN NPN
.model PNP PNP
.lib standard.bjt
* .tran 1m
.ac dec 250 10 1Meg
.lib OPAx197.LIB
.lib INA828.LIB
.backanno
.end

* Results of the author's LTspice run, read from the files saved beside the schematic
* Operating Point, zero values left out:
*   V(+18v) = 18 V
*   V(-18v) = -18 V
*   V(3.3v) = 3.3 V
*   V(i) = 1.65 V
*   V(n002) = 25 µV
*   V(v) = 1.65 V
*   I(R1) = -25 nA
*   I(V3) = -330 µA
*   I(V4) = 24.85 nA
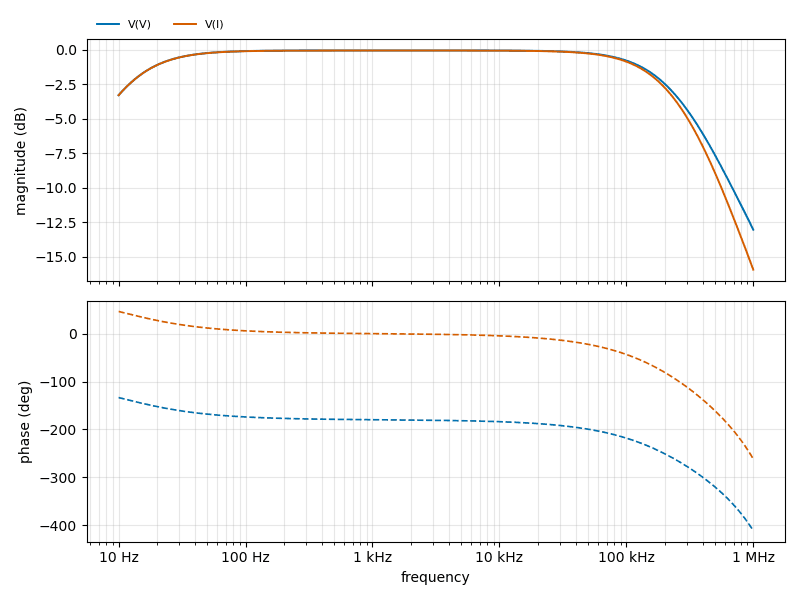
[diagram p3: AC Analysis of Characterise.asc, plotted from the saved traces]
* AC Analysis, 1 run:
*   V(V): -3.27 dB at 10 Hz, -13.03 dB at 1 MHz, peak -0.03 dB at 1.57 kHz, 3 dB below the peak at 10.53 Hz and 232 kHz
*   V(I): -3.28 dB at 10 Hz, -15.92 dB at 1 MHz, peak -0.04 dB at 1.528 kHz, 3 dB below the peak at 10.53 Hz and 215.6 kHz